# EAGLE design PCB-DISP64x32 (EAGLE 7.5.0)

## Sheet 1 of 2
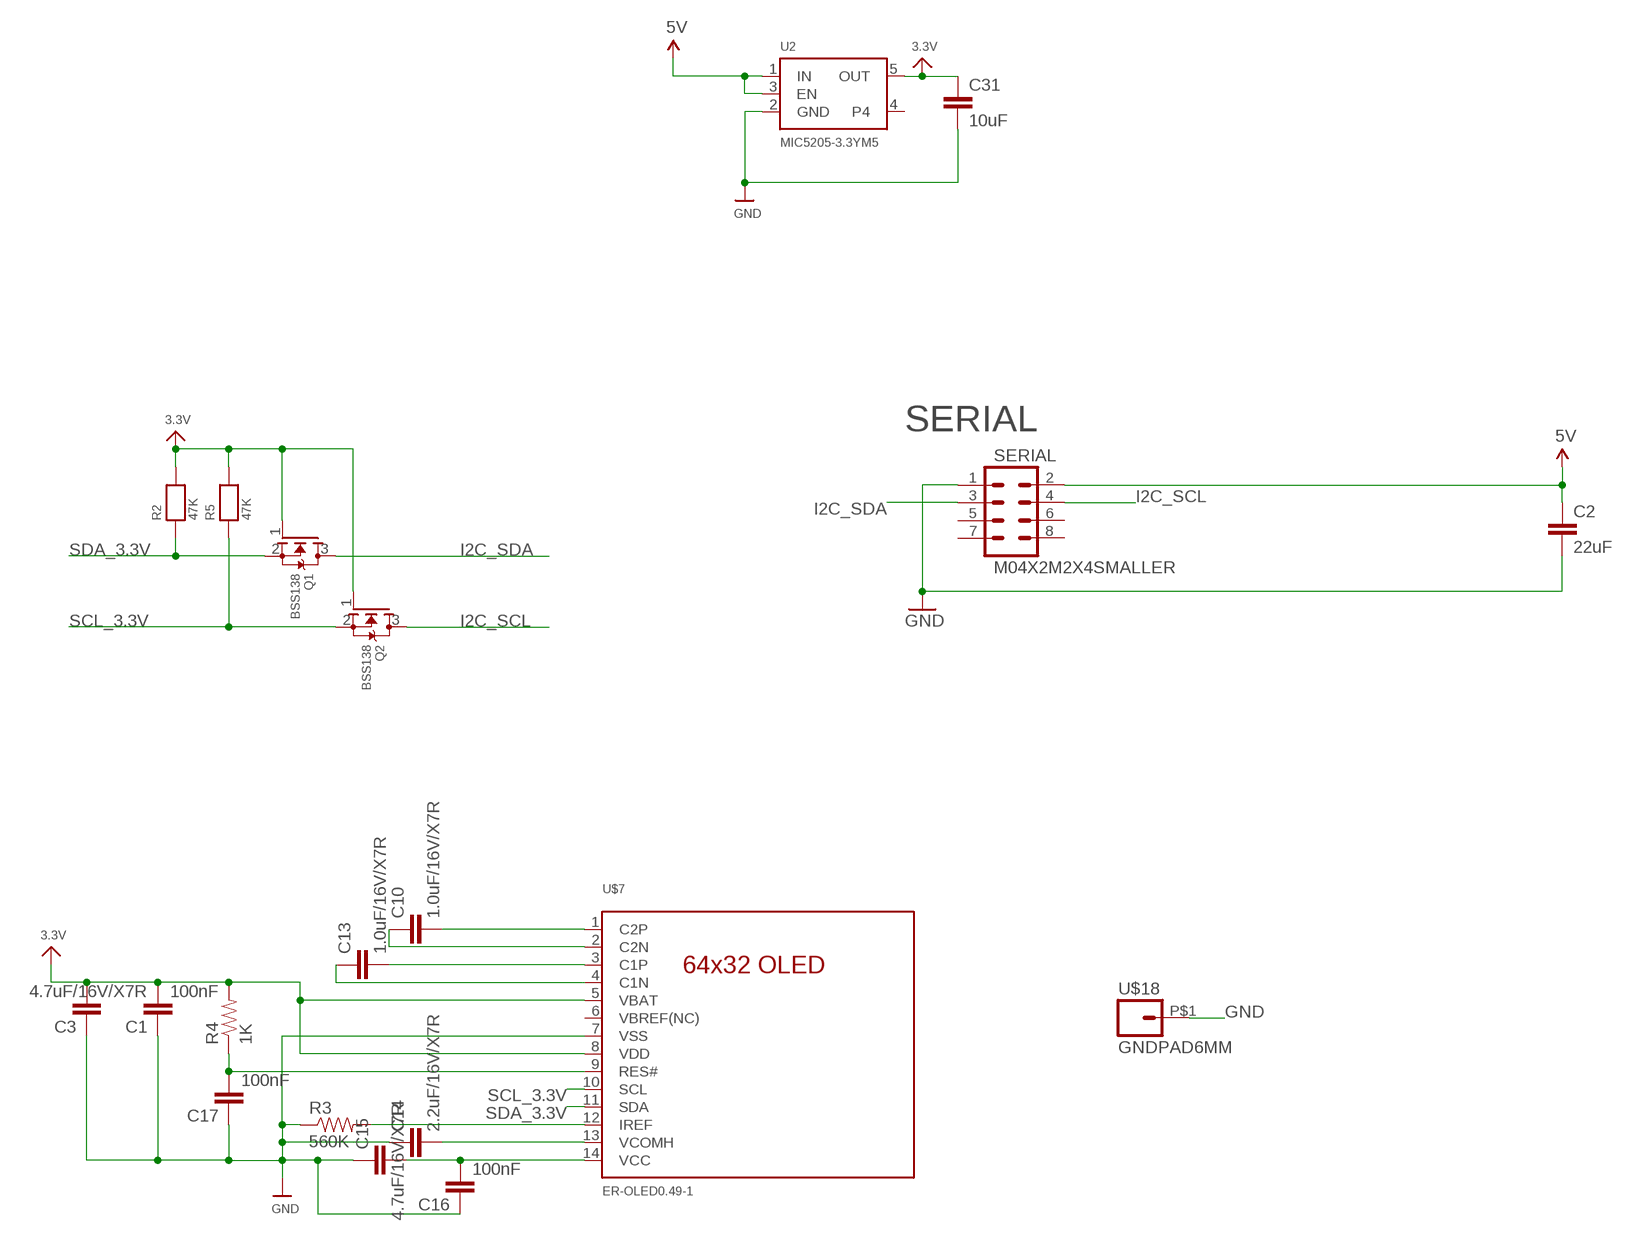
[diagram p0: schematic, sheet 1]

### Parts
C1  100nF  CAP0603-CAP  [0603-CAP]
C2  22uF  CAP0805  [0805]
C3  4.7uF/16V/X7R  CAP0603-CAP  [0603-CAP]
C10  1.0uF/16V/X7R  CAP0603-CAP  [0603-CAP]
C13  1.0uF/16V/X7R  CAP0603-CAP  [0603-CAP]
C14  2.2uF/16V/X7R  CAP0603-CAP  [0603-CAP]
C15  4.7uF/16V/X7R  CAP0603-CAP  [0603-CAP]
C16  100nF  CAP0603-CAP  [0603-CAP]
C17  100nF  CAP0603-CAP  [0603-CAP]
C31  10uF  CAP0805  [0805]
Q1  BSS138  MOSFET-NREFLOW  [SOT23-R]
Q2  BSS138  MOSFET-NREFLOW  [SOT23-R]
R2  47K  RESISTOR0603  [0603]
R3  560K  RESISTOR0603-RES  [0603-RES]
R4  1K  RESISTOR0603-RES  [0603-RES]
R5  47K  RESISTOR0603  [0603]
SERIAL  M04X2M2X4SMALLER  [M2X4SMALLER]
U2  MIC5205-3.3YM5  VREG_SOT23-5  [SOT23-5]
U$7  ER-OLED0.49-1  [ER-OLED0.49-1_WRAPAROUND]
U$18  GNDPAD6MM  [3.2MMPAD6MM]

### Nets
3.3V [Power]: C1.2 C3.2 C31.1 Q1.1(G) Q2.1(G) R2.2 R4.2 R5.2 U2.5(OUT) U$7.5(VBAT) U$7.8(VDD)
5V [Power]: C2.1 SERIAL.2 U2.1(IN) U2.3(EN)
GND [Power]: C1.1 C2.2 C3.1 C14.1 C15.1 C16.1 C17.1 C31.2 R3.1 SERIAL.1 U2.2(GND) U$7.7(VSS) U$18.P$1
I2C_SCL: Q2.3(D) SERIAL.4
I2C_SDA: Q1.3(D) SERIAL.3
N$6: C10.2 U$7.1(C2P)
N$10: C13.2 U$7.3(C1P)
N$11: C13.1 U$7.4(C1N)
N$12: C10.1 U$7.2(C2N)
N$13: R3.2 U$7.12(IREF)
N$14: C14.2 U$7.13(VCOMH)
N$15: C15.2 C16.2 U$7.14(VCC)
N$123: C17.2 R4.1 U$7.9(RES#)
SCL_3.3V: Q2.2(S) R5.1 U$7.10(SCL)
SDA_3.3V: Q1.2(S) R2.1 U$7.11(SDA)
Unconnected: SERIAL.5 SERIAL.6 SERIAL.7 SERIAL.8 U2.4 U$7.6(VBREF(NC))

### Notes on the sheet
- SERIAL

## Sheet 2 of 2

## Library data of the parts
C1-C3 C10 C13-C17 C31 = SparkFun:CAP: Capacitor Standard 0603 ceramic capacitor, and 0.1" leaded capacitor.
Q1 Q2 = microbuilder:MOSFET-N: N-Channel Mosfet LEGEND VDS: Voltage Drain-Source ID: Drain Current RDS(ON): Drain-Source On-State Resistance VGS(TH): Gate-Source Threshold Voltage CISS: Drain-Source Input Capacitance SOT-23 Name VDS ID RDS(ON) VGS(TH) CISS Order Number 2N7002E 60V 260mA 2.5 Ohm 2.5V @ 250uA 26.7pF @ 25V 2N7002ET1GOSTR-ND BSH103 30V 850mA 400 mOhm 400mV @ 1mA 83pF @ 24V BSH103,235-ND BSS138 60V 320mA 1.6 Ohm 1.5V @ 250uA 50pF @ 10V Mouser: 771-BSS138PW115 DMN2075U-7 20V 4.2A 38 mOhm 1V @ 250 uA 594.3pF @ 10V DMN2075U-7DICT-ND * BSS138 good choice for I2C level-shifting
R2 R5 = microbuilder:RESISTOR: Resistors 0402 - 0402 Surface Mount Package 22 Ohm 1% 1/16W [Digikey: 311-22.0LRTR-ND] 33 Ohm 5% 1/16W 1.0K 5% 1/16W 1.5K 5% 1/16W 2.0K 1% 1/16W 10.0K 1% 1/16W [Digikey: 311-10.0KLRTR-ND] 10.0K 5% 1/16W [Digikey: RMCF0402JT10K0TR-ND] 12.1K 1% 1/16W [Digikey: 311-22.0LRTR-ND] 100.0K 5% 1/16W 0603 - 0603 Surface Mount Package 0 Ohm 1/10 Watt 1% Resistor 15 Ohm 1/10 Watt 1% Resistor 33 Ohm 1/10 Watt 1% Resistor 49.9 Ohm 1/10 Watt 1% Resistor 100 Ohm 1/10 Watt 1% Resistor 150 Ohm 1/10 Watt 1% Resistor 240 Ohm 1/10 Watt 1% Resistor 390 Ohm 1/10 Watt 1% Resistor 560 Ohm 1/10 Watt 1% Resistor 680 Ohm 1/10 Watt 1% Resistor 750 Ohm 1/10 Watt 1% Resistor 1.0K Ohm 1/10 Watt 1% Resistor 1.5K Ohm 1/10 Watt 1% Resistor 2.0K Ohm 1/10 Watt 1% Resistor 2.2K Ohm 1/10 Watt 1% Resistor 3.3K Ohm 1/10 Watt 1% Resistor 4.7K Ohm 1/10 Watt 1% Resistor 10.0K Ohm 1/10 Watt 1% Resistor 12.0K Ohm 1/10 Watt 1% Resistor 12.1K Ohm 1/10 Watt 1% Resistor 20.0K Ohm 1/10 Watt 1% Resistor 33.0K Ohm 1/10 Watt 1% Resistor 100.0K Ohm 1/10 Watt 1% Resistor 0805 - 0805 Surface Mount Package 0 Ohm 1/8 Watt 1% Resistor 33 Ohm 1/8 Watt 1% Resistor 100 Ohm 1/8 Watt 1% Resistor 150 Ohm 1/8 Watt 1% Resistor 200 Ohm 1/8 Watt 1% Resistor 240 Ohm 1/8 Watt 1% Resistor 330 Ohm 1/8 Watt 1% Resistor 390 Ohm 1/8 Watt 1% Resistor 470 Ohm 1/8 Watt 1% Resistor 1.0K Ohm 1/8 Watt 1% Resistor 1.5K Ohm 1/8 Watt 1% Resistor 2.0K Ohm 1/8 Watt 1% Resistor 4.7K Ohm 1/8 Watt 1% Resistor 5.1K Ohm 1/8 Watt 1% Resistor 5.6K Ohm 1/8 Watt 1% Resistor 10.0K Ohm 1/8 Watt 1% Resistor 22.0K Ohm 1/8 Watt 1% Resistor 33.0K Ohm 1/8 Watt 1% Resistor 100K Ohm 1/8 Watt 1% Resistor 1206 - 1206 Surface Mount Package 2012 - 2010 Surface Mount Package 0.11 Ohm 1/2 Watt 1% Resistor - Digikey: RHM.11UCT-ND
R3 R4 = SparkFun:RESISTOR: Resistor Basic schematic elements and footprints for 0603, 1206, and PTH resistors.
SERIAL = SKAARHOJ:M04X2
U2 = microbuilder:VREG_SOT23-5: SOT23-5 Fixed Voltage Regulators To better organise some of the SOT23-5 fixed voltage regulators in this library, this new part was created. Part Current Out V Out V In V Dropout Digikey Part No. ADP121 150mA 3.3V 3.4-5.5V 0.09V @ 150mA ADP121-AUJZ33R7CT-ND ADP121 150mA 3.0V 3.1-5.5V 0.09V @ 150mA ADP121-AUJZ30R7CT-ND ADP122 300mA 3.3V 3.4-5.5V 0.085V @ 300mA ADP122AUJZ-3.3-R7CT-ND ADP1712 300mA 3.3V 3.5-5.5V 0.17V @ 300mA ADP1712AUJZ-3.3-R7TR-ND AP7311 (Low Cost) 150mA 3.3V 3.5-6V 0.15V @ 150mA AP7311-33WG-7DICT-ND LD39015M18R 150mA 1.8V 1.9V-5.5V 0.08V @ 100mA 497-6977-1-ND MCP1824T-3302E/OT 300mA 3.3V 3.5V-6V 0.2V @ 300mA MCP1824T-3302E/OTCT-ND MIC5205-2.5YM5 TR 150mA 2.5V 2.7-16V 0.165V @ 150mA 576-1257-2-ND MIC5205-3.0YM5 TR 150mA 3.0V 3.2V-16V 0.165V @ 150mA 576-1258-2-ND MIC5205-3.3YM5 TR 150mA 3.3V 3.5V-16V 0.165V @ 150mA 576-1259-2-ND TPS780330220 150mA 3.3V+2.2V 3.6-5.5V 250mV Max 296-23332-1-ND TDA3663/N1,135 100mA 3.3V 3.5-45V 0.18V @ 50mA 568-5343-1-ND
U$7 = SKAARHOJ:ER-OLED0.49-1
U$18 = SKAARHOJ:GNDPAD

## Net classes
0 default: width 0.203 mm, drill 0.406 mm, clearance 0.152 mm
1 Power: width 0.406 mm, drill 0.61 mm, clearance 0.203 mm

## Board
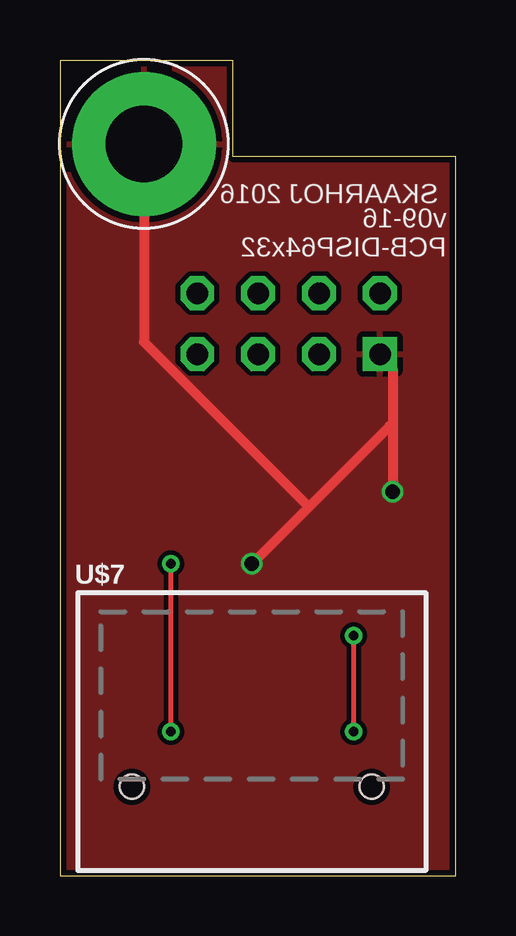
[diagram p1: board, top side]
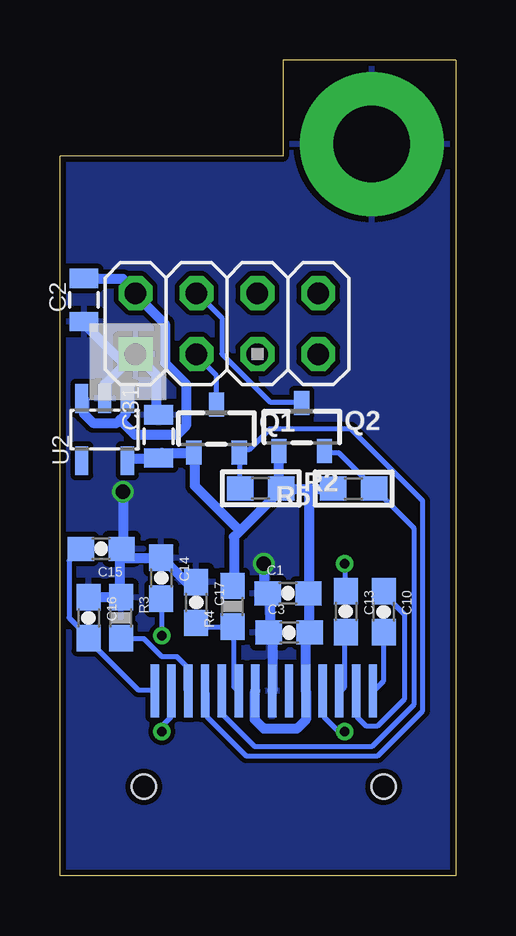
[diagram p2: board, bottom side, seen from below]

Size 16.5 x 34 mm. Coordinates in mm from the lower left corner, seen from the top.
Outline: 16.5,0 16.5,30 7.21,30 7.21,34 0,34 0,0 16.5,0
Copper layers (1*16): Top 0.035mm / dielectric 1.5mm / Bottom 0.035mm
Design rules "Fusion_eagle_rule_v1.1": minimum track width 6mil, minimum drill 12mil, track to track 6mil, track to pad 6mil, pad to pad 6mil, via to via 6mil, smd to smd 0mil, copper to edge 10mil, drill to drill 10mil, minimum pad ring 10mil, minimum via ring 6mil, stop-mask expansion 2mil, vias tented up to drill 100mil, thermal gap 10mil

### Footprints (pad centres in the part's own frame; a part is rotated, then mirrored left to right if it is on the bottom)
0603-CAP = smd 1.1 x 1: 1 -0.85,0; 2 0.85,0
0805 = smd 0.8 x 1.2: 1 -0.9,0; 2 0.9,0
SOT23-R = smd 0.635 x 1.016: 1 -0.95,-1; 2 0.95,-1; 3 0,1
0603 = smd 1.1 x 1: 1 -0.85,0; 2 0.85,0
0603-RES = smd 1.1 x 1: 1 -0.85,0; 2 0.85,0
M2X4SMALLER = drill 0.9 square: 1 -1.27,3.81 | drill 0.9 octagon: 2 1.27,3.81; 3 -1.27,1.27; 4 1.27,1.27; 5 -1.27,-1.27; 6 1.27,-1.27; 7 -1.27,-3.81; 8 1.27,-3.81
SOT23-5 = smd 0.55 x 1.2: 1 -0.95,-1.3; 2 0,-1.3; 3 0.95,-1.3; 4 0.95,1.3; 5 -0.95,1.3
ER-OLED0.49-1_WRAPAROUND = smd 0.35 x 2.2 bottom: 1 -4.55,1.7; 2 -3.85,1.7; 3 -3.15,1.7; 4 -2.45,1.7; 5 -1.75,1.7; 6 -1.05,1.7; 7 -0.35,1.7; 8 0.35,1.7; 9 1.05,1.7; 10 1.75,1.7; 11 2.45,1.7; 12 3.15,1.7; 13 3.85,1.7; 14 4.55,1.7 | hole 1: -5,-2.3; 5,-2.3
3.2MMPAD6MM = drill 3.2 pad 6: P$1 0,0

### Placement (x,y rotation side)
C1  6.98,11.76 0 bottom
C2  15.5,24 270 bottom
C3  6.94,10.13 0 bottom
C10  3,11 270 bottom
C13  4.58,11 270 bottom
C14  12.28,12.4 270 bottom
C15  14.78,13.62 180 bottom
C16  15.31,10.75 270 bottom
C17  10.81,11.38 270 bottom
C31  12.38,18.3 90 bottom
Q1  9.97,18.64 0 bottom
Q2  6.41,18.7 0 bottom
R2  8.13,16.14 0 bottom
R3  13.96,10.75 270 bottom
R4  9.3,11.22 90 bottom
R5  4.25,16.13 180 bottom
SERIAL  9.54,23.01 90 bottom
U2  14.64,18.59 180 bottom
U$7  8,6 0 top
U$18  3.5,30.5 0 top

### Tracks (layer width: path | path; a pad name or v marks a point on that pad's centre or on a via)
3.3V
  Bottom 0.406: U$7.8 8.38,7.62 8.38,6.5 8,6.12 6.62,6.12 6.25,6.5 U$7.5 6.25,10 C3.2 6.12,10.25 C1.2 6.12,11.88 6.12,16.12 | U2.5 13.62,17.38 12.5,17.38 C31.1 12.38,17.5 12.25,17.62 11,17.62 Q1.1 10.88,17.5 10.88,16.25 9,14.38 | Q2.1 7.38,17.62 7.38,16.25 R2.2 | 9,14.38 7.38,16 R2.2 | 9,14.38 9.25,14.12 9.25,12.12 R4.2 | 6.12,16.12 7.12,16.12 R2.2 | 6.12,16.12 5.12,16.12 R5.2
5V
  Bottom 0.406: 14,19 14.12,18.88 15.12,18.88 15.5,19.25 15.5,19.88 U2.3 | 14,19 13.75,19.25 13.75,19.88 U2.1 | C2.1 15.5,24.88 13.88,24.88 13.38,24.38 SERIAL.2 13.25,24.12 12.12,23 12.12,21.38 11.25,20.5 11.25,18.75 11.62,18.38 13.38,18.38 14,19
GND  (via drill 0.61)
  Top 0.406: 13.88,18.75 13.88,21.12 13.38,21.62 SERIAL.1 | 13.88,18.75 v13.88,16 | 10.38,15.38 13.75,18.75 13.88,18.75 | 10.38,15.38 v8,13 | 10.38,15.38 3.5,22.25 U$18.P$1
  Bottom 0.406: U$7.7 7.62,7.75 7.62,10 C3.1 7.75,10.25 7.75,11.75 C1.1 8,11.88 v8,13 | C17.1 10.88,12.25 11.25,12.25 12.25,13.25 C14.1 12.38,13.25 13.88,13.25 C15.1 | C16.1 15.25,11.62 14,11.62 R3.1 14,11.75 14,13.5 C15.1 | C31.2 12.5,19.25 12.5,20.88 13.25,21.62 SERIAL.1 | U2.2 14.62,20 14.62,20.5 13.5,21.62 SERIAL.1 | C2.2 15.5,23 13.88,21.38 SERIAL.1 | v13.88,16 13.88,13.75 C15.1
  pour Top: 0,0 17,0 17,34 0,34
  pour Bottom: 0,0 17,0 17,34 0,34
I2C_SCL
  Bottom 0.203: Q2.3 6.5,19.75 7.75,19.75 9.75,21.75 9.75,23.25 10.75,24.25 SERIAL.4
I2C_SDA
  Bottom 0.203: Q1.3 10,19.75 10,20.88 10.75,21.62 SERIAL.3
N$6
  Bottom 0.203: C10.2 3,8.12 3.38,7.75 U$7.1
N$10
  Bottom 0.203: C13.2 4.62,10.12 4.62,7.88 4.75,7.75 U$7.3
N$11  (via drill 0.41)
  Top 0.203: v4.62,6 v4.62,13
  Bottom 0.203: v4.62,13 4.62,11.88 C13.1 | v4.62,6 4.88,6 5.5,6.62 5.5,7.62 U$7.4
N$12
  Bottom 0.203: C10.1 3,11.75 2.12,10.88 2.12,7.38 3.25,6.25 3.75,6.25 4.12,6.62 4.12,7.62 U$7.2
N$13
  Bottom 0.203: R3.2 13.88,9.88 13,9.88 12.25,9.12 11.62,9.12 11.25,8.75 11.25,7.75 U$7.12
N$14  (via drill 0.41)
  Top 0.203: v12.25,6 v12.25,10
  Bottom 0.203: v12.25,10 12.25,11.5 C14.2 | v12.25,6 12.25,6.25 11.88,6.62 11.88,7.62 U$7.13
N$15
  Bottom 0.203: C15.2 15.75,13.5 16.12,13.12 16.12,10.75 15.38,10 C16.2 15.38,9.88 13.25,7.75 12.62,7.75 U$7.14
N$123
  Bottom 0.203: C17.2 10.75,10.5 10.62,10.38 9.38,10.38 R4.1 9.25,10.25 9.25,7.88 9.12,7.75 U$7.9
SCL_3.3V
  Bottom 0.203: Q2.2 5.38,17.62 4.88,17.62 3.5,16.25 R5.1 3.38,16.12 1.75,14.5 1.75,7.12 3.5,5.38 8.38,5.38 9.75,6.75 U$7.10
SDA_3.3V
  Bottom 0.203: R2.1 9,16.25 9,17.62 Q1.2 9,17.75 8.62,17.75 7.75,18.62 4.38,18.62 1.38,15.62 1.38,6.88 3.25,5 8.75,5 10.38,6.62 10.38,7.62 U$7.11

### Text on the board
_tsilk: SKAARHOJ 2016 | v09-16 / PCB-DISP64x32